# Altium schematic sheet TPS54531.SchDoc
size A4
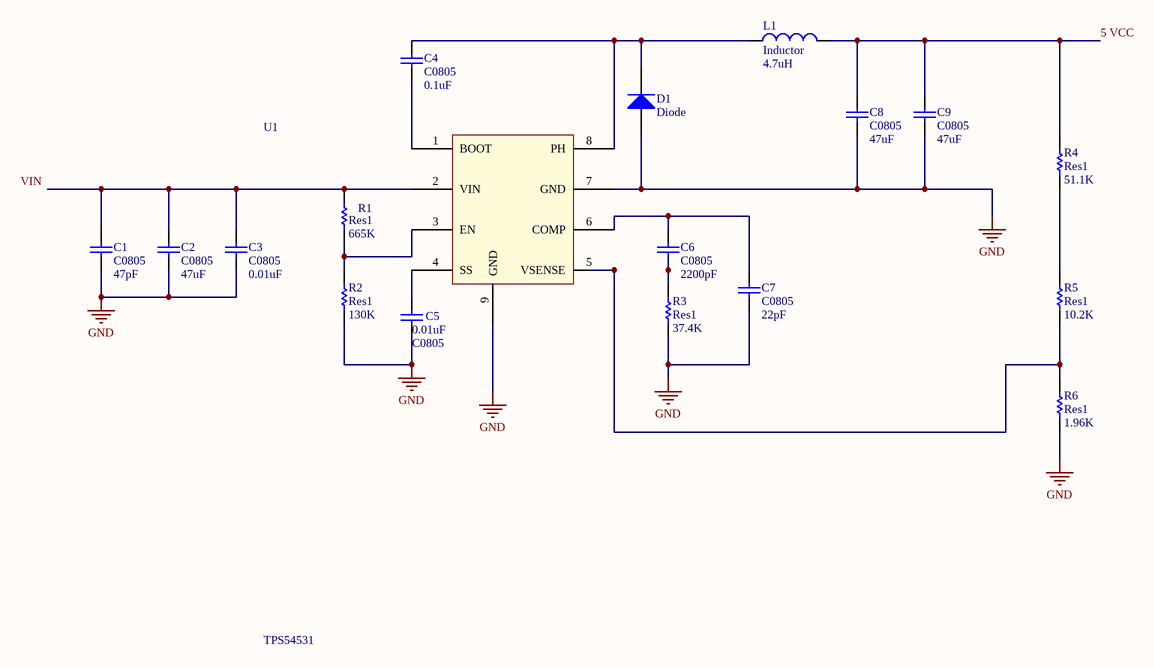
[diagram p0: TPS54531.SchDoc]

## Parts
C1  C0805  value 47pF  [0805]
C2  C0805  value 47uF  [0805]
C3  C0805  value 0.01uF  [0805]
C4  C0805  value 0.1uF  [0805]
C5  C0805  value 0.01uF  [0805]
C6  C0805  value 2200pF  [0805]
C7  C0805  value 22pF  [0805]
C8  C0805  value 47uF  [0805]
C9  C0805  value 47uF  [0805]
D1  Diode  [SMC]
L1  Inductor  value 4.7uH  [0402-A]
R1  Res1  value 665K  [AXIAL-0.3]
R2  Res1  value 130K  [AXIAL-0.3]
R3  Res1  value 37.4K  [AXIAL-0.3]
R4  Res1  value 51.1K  [AXIAL-0.3]
R5  Res1  value 10.2K  [AXIAL-0.3]
R6  Res1  value 1.96K  [AXIAL-0.3]
U1  TPS54531

## Nets
GND: C1.1 C2.1 C3.1 C5.1 C7.1 C8.1 C9.1 D1.1(A) R2.1 R3.1 R6.1 U1.7(GND) U1.9(GND)
5 VCC: C8.2 C9.2 L1.2 R4.2
NetC1_2: C1.2 C2.2 C3.2 R1.2 U1.2(VIN)
NetC4_1: C4.1 U1.1(BOOT)
NetC4_2: C4.2 D1.2(K) L1.1 U1.8(PH)
NetC5_2: C5.2 U1.4(SS)
NetC6_1: C6.1 R3.2
NetC6_2: C6.2 C7.2 U1.6(COMP)
NetR1_1: R1.1 R2.2 U1.3(EN)
NetR4_1: R4.1 R5.2
NetR5_1: R5.1 R6.2 U1.5(VSENSE)

## Notes on the sheet
- Labels drawn without touching a wire or pin: VIN

## Library data of the parts
C1-C9 = C0805: Ceramic Chip Capacitor - Standard; Note: Footprint corresponds to dimensions for bulk cassette packaging. This case size has tightened tolerances.; Published: 17-Jul-2002; LatestRevisionDate: 19-Mar-2004; LatestRevisionNote: Silkscreen size reduced.; DatasheetDocument: Mar-2001; PackageDocument: Mar-2001; PackageReference: 0805; Publisher: Altium Limited; Code_JEITA: 0805; Code_IPC: 2012[0805]; ComponentLink1Description: Manufacturer Link; ComponentLink1URL: http://www.kemet.com/; ComponentLink2Description: Datasheet; ComponentLink2URL: http://www.kemet.com/kemet/web/homepage/kechome.nsf/vapubfilesname/F3102TA.pdf/$file/F3102TA.pdf
D1 = Diode: Default Diode; Published: 8-Jun-2000; LatestRevisionDate: 17-Jul-2002; LatestRevisionNote: Re-released for DXP Platform.; PackageVersion: Sep-1996; PackageReference: SMC; Publisher: Altium Limited; PackageDescription: DO-214-AB/SMC; 2 C-Bend Leads; Body 7.9 x 5.9 mm, inc. leads (LxW); Code_JEDEC: DO-214-AB
L1 = Inductor: Code_IEC: 1005; Published: 8-Jun-2000; LatestRevisionDate: 29-May-2009; LatestRevisionNote: IPC-7351 Footprint Added.; PackageReference: 0402-A; Publisher: Altium Limited; PackageDescription: Chip Inductor; Code_JEITA: 0402
R1-R6 = Res1: Resistor; Published: 8-Jun-2000; LatestRevisionDate: 17-Jul-2002; LatestRevisionNote: Re-released for DXP Platform.; PackageReference: AXIAL-0.3; Publisher: Altium Limited; PackageDescription: Axial Device, Thru-Hole; 2 Leads; 0.3 in Pin Spacing
U1 = Component_1